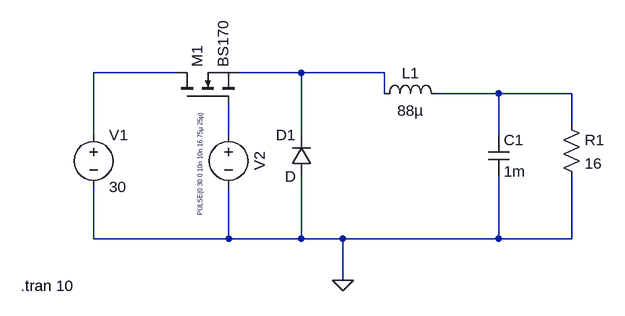
[diagram p0: schematic buck 30-20.asc]
buck 30-20.asc, the LTspice schematic file:
Version 4.1
SHEET 1 880 680
WIRE -80 32 -208 32
WIRE 112 32 16 32
WIRE 240 32 112 32
WIRE 240 64 240 32
WIRE 416 64 320 64
WIRE 528 64 416 64
WIRE 528 112 528 64
WIRE -208 128 -208 32
WIRE 0 128 0 80
WIRE 112 128 112 32
WIRE 416 128 416 64
WIRE -208 288 -208 208
WIRE 0 288 0 208
WIRE 0 288 -208 288
WIRE 112 288 112 192
WIRE 112 288 0 288
WIRE 176 288 112 288
WIRE 416 288 416 192
WIRE 416 288 176 288
WIRE 528 288 528 192
WIRE 528 288 416 288
WIRE 176 352 176 288
FLAG 176 352 0
SYMBOL voltage -208 112 R0
WINDOW 123 0 0 Left 0
WINDOW 39 0 0 Left 0
SYMATTR InstName V1
SYMATTR Value 30
SYMBOL diode 128 192 R180
WINDOW 0 24 64 Left 2
WINDOW 3 24 0 Left 2
SYMATTR InstName D1
SYMBOL ind 224 80 R270
WINDOW 0 32 56 VTop 2
WINDOW 3 5 56 VBottom 2
SYMATTR InstName L1
SYMATTR Value 88µ
SYMBOL cap 400 128 R0
SYMATTR InstName C1
SYMATTR Value 1m
SYMBOL res 512 96 R0
SYMATTR InstName R1
SYMATTR Value 16
SYMBOL nmos -80 80 R270
SYMATTR InstName M1
SYMATTR Value BS170
SYMBOL voltage 0 112 R0
WINDOW 0 32 56 VTop 2
WINDOW 3 -37 60 VBottom 0
WINDOW 123 0 0 Left 0
WINDOW 39 0 0 Left 0
SYMATTR InstName V2
SYMATTR Value PULSE(0 30 0 10n 10n 16.75µ 25µ)
TEXT -320 360 Left 2 !.tran 10

The netlist it stands for:
* buck 30-20.asc
V1 N001 0 30
D1 0 N002 D
L1 N002 N003 88µ
C1 N003 0 1m
R1 N003 0 16
M1 N001 N004 N002 N002 BS170
V2 N004 0 PULSE(0 30 0 10n 10n 16.75µ 25µ)
.model D D
.lib standard.dio
.model NMOS NMOS
.model PMOS PMOS
.lib standard.mos
.tran 10
.backanno
.end